# EAGLE design coronakiller_Zusatzplatine (EAGLE 9.6.2)
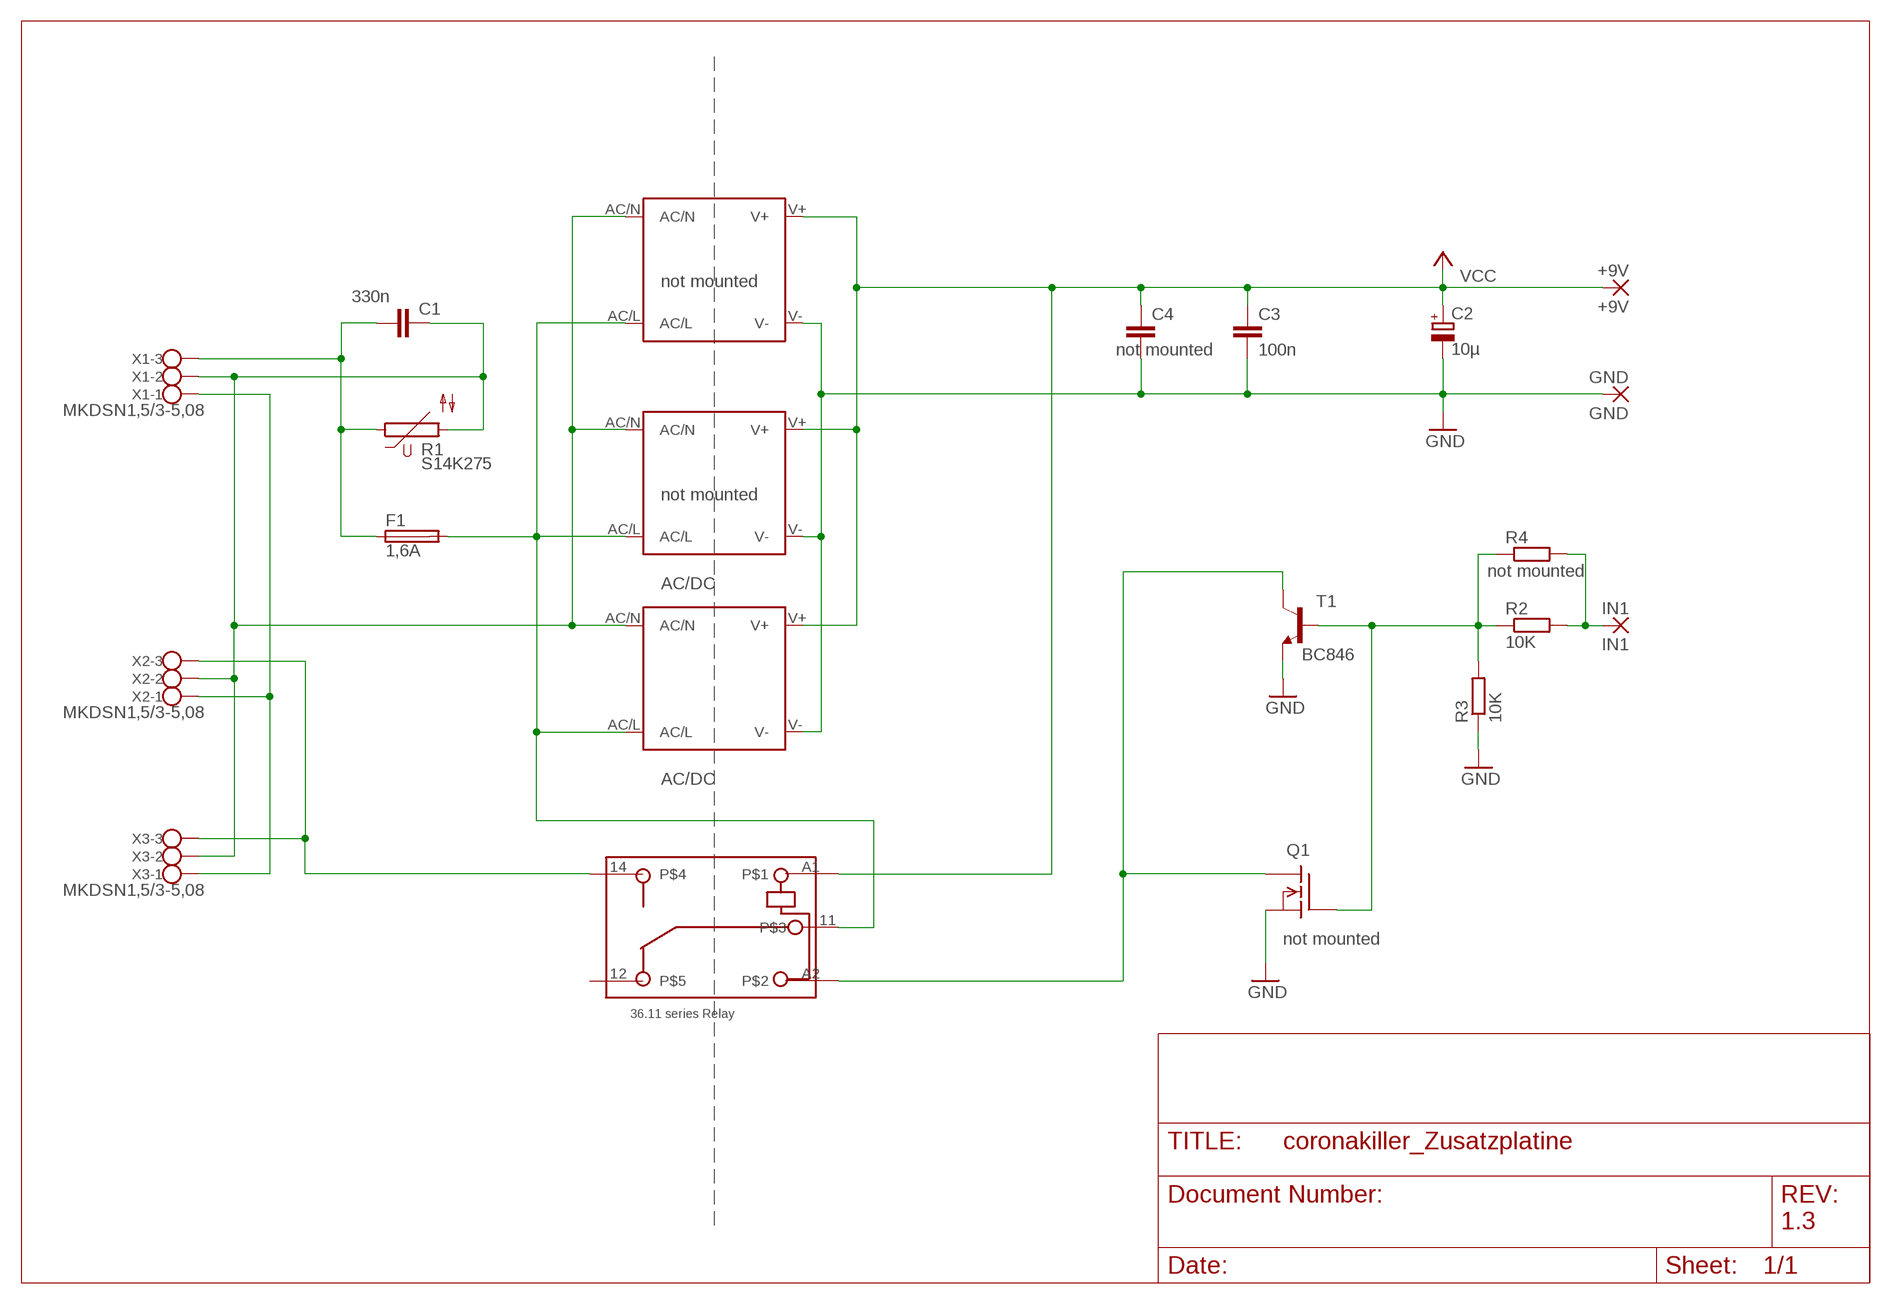
[diagram p0: schematic, sheet 1]

## Parts
+9V  +9V  2,54/1,0  [2,54/1,0]
AC/DC  AC/DC  IRM_03  [IRM_03]
C1  330n  C-EU150-054X183  [C150-054X183]
C2  10µ  CPOL-EUE2.5-6  [E2,5-6]
C3  100n  C-EUC0805  [C0805]
C4  not mounted  C-EU025-040X050  [C025-040X050]
F1  1,6A  FUSESH22,5  [SH22,5]
GND  GND  2,54/1,0  [2,54/1,0]
IN1  IN1  2,54/1,0  [2,54/1,0]
K1  36.11  [36.11]
Q1  BSS101  [TO92]
R1  S14K275  [S14K275]
R2  10K  R-EU_R0805  [R0805]
R3  10K  R-EU_R0805  [R0805]
R4  not mounted  R-EU_V526-0  [V526-0]
T1  BC846  [SOT23]
U$1  not mounted  IRM_01/02IRM_01/02  [IRM_01/02]
U$2  not mounted  IRM_01/02_SMDIRM_01/02_SMD  [IRM_01/02_SMD]
X1  MKDSN1,5/3-5,08  [MKDSN1,5/3-5,08]
X2  MKDSN1,5/3-5,08  [MKDSN1,5/3-5,08]
X3  MKDSN1,5/3-5,08  [MKDSN1,5/3-5,08]

## Nets
GND: AC/DC.V- C2.- C3.2 C4.2 GND.1(P) Q1.1(S) R3.1 T1.2(E) U$1.V- U$2.V-
N$1: C1.2 F1.1 R1.1 X1.3
N$2: AC/DC.AC/N C1.1 R1.2 U$1.AC/N U$2.AC/N X1.2 X2.2 X3.2
N$3: X1.1 X2.1 X3.1
N$4: AC/DC.AC/L F1.2 K1.11 U$1.AC/L U$2.AC/L
N$5: K1.A2 Q1.3(D) T1.3(C)
N$6: Q1.2(G) R2.1 R3.2 R4.1 T1.1(B)
N$7: IN1.1(P) R2.2 R4.2
N$8: K1.14 X2.3 X3.3
VCC: +9V.1(P) AC/DC.V+ C2.+ C3.1 C4.1 K1.A1 U$1.V+ U$2.V+
Unconnected: K1.12

## Notes on the sheet
- not mounted
- 1.3

## Library data of the parts
+9V GND IN1 = wirepad:2,54/1,0: THROUGH-HOLE PAD
AC/DC = meanwell_irm_v6:IRM_03: 3 watt IRM 03 Vout [V] Imax [A] Pmax [W] Eff [%] 3.3 0.9 3 68 5 0.6 3 72 9 0.33 3 77 12 0.25 3 78 15 0.2 3 78 24 0.125 3 80
C1 C3 C4 = rcl:C-EU: CAPACITOR, European symbol; SPICEPREFIX: C
C2 = rcl:CPOL-EU: POLARIZED CAPACITOR, European symbol; SPICEPREFIX: C
F1 = fuse:FUSE: Fuse; OC_FARNELL: unknown; OC_NEWARK: unknown
K1 = relay_finder_36_11:36.11: Printed circuit mount miniature 10 A relay one pole changeover contacts Conform RoHS
Q1 = transistor-fet:BSS101: N-Channel Enhancement MOSFET 200V; 0,16A; 11Ohm
R1 = varistor:S14K275: VARISTOR
R2-R4 = rcl:R-EU_: RESISTOR, European symbol; SPICEPREFIX: R
T1 = transistor-neu-to92:BC846: NPN TRANSISTOR
U$1 = OhneAlles:IRM_01/02: 1 or 2 watt housing & pin compatible IRM 01 Vout [V] Imax [A] Pmax [W] Eff [%] 3.3 0.3 1 66 5 0.2 1 70 9 0.111 1 72 12 0.083 1 74 15 0.067 1 75 24 0.042 1 77 IRM 2 Vout [V] Imax [A] Pmax [W] Eff [%] 3.3 0.6 2 66 5 0.4 2 70 9 0.222 2 72 12 0.167 2 74 15 0.133 2 75 24 0.087 2 77
U$2 = OhneAlles:IRM_01/02_SMD: 1 or 2 watt housing & pin compatible IRM 01 Vout [V] Imax [A] Pmax [W] Eff [%] 3.3 0.3 1 66 5 0.2 1 70 9 0.111 1 72 12 0.083 1 74 15 0.067 1 75 24 0.042 1 77 IRM 2 Vout [V] Imax [A] Pmax [W] Eff [%] 3.3 0.6 2 66 5 0.4 2 70 9 0.222 2 72 12 0.167 2 74 15 0.133 2 75 24 0.087 2 77
X1-X3 = con-phoenix-508:MKDSN1,5/3-5,08: MKDSN 1,5/ 3-5,08 Printklemme Nennstrom: 13,5 A Nennspannung: 250 V Rastermaß: 5,08 mm Polzahl: 3 Anschlussart: Schraubanschluss Montage: Löten Anschlussrichtung Leiter/Platine: 0 ° Artikelnummer: 1729131 Source: http://eshop.phoenixcontact.com .. 1729131.pdf

## Board
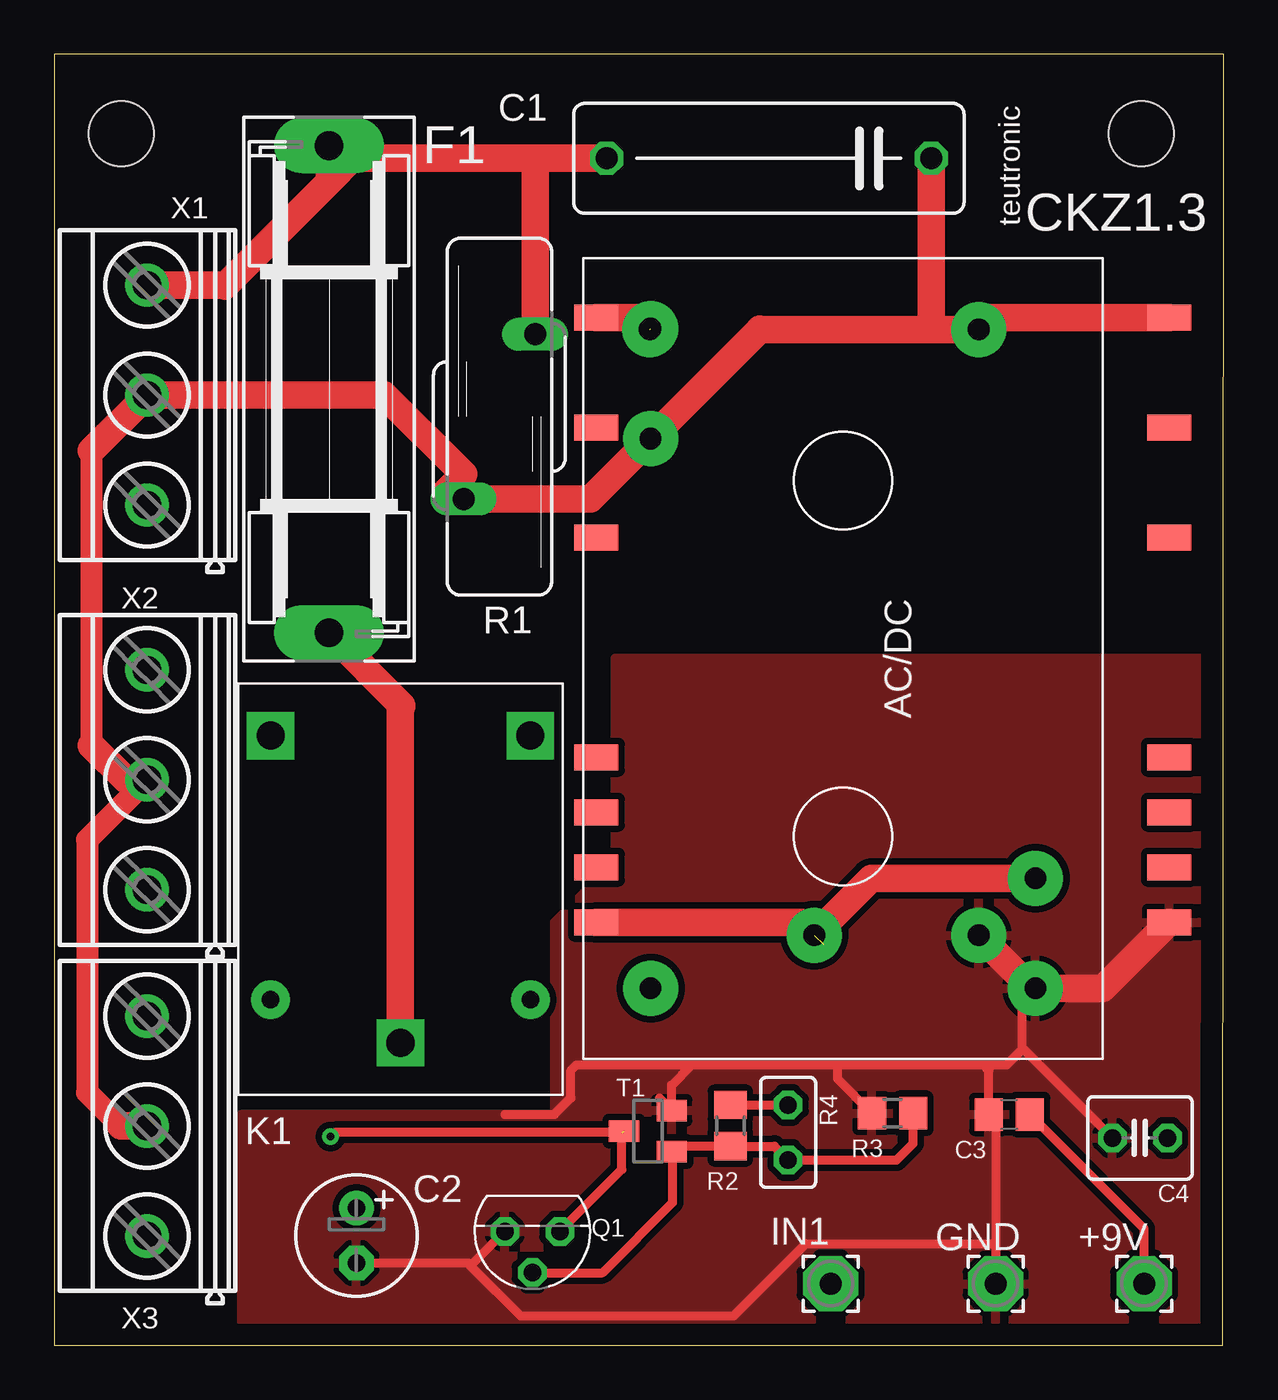
[diagram p1: board, top side]
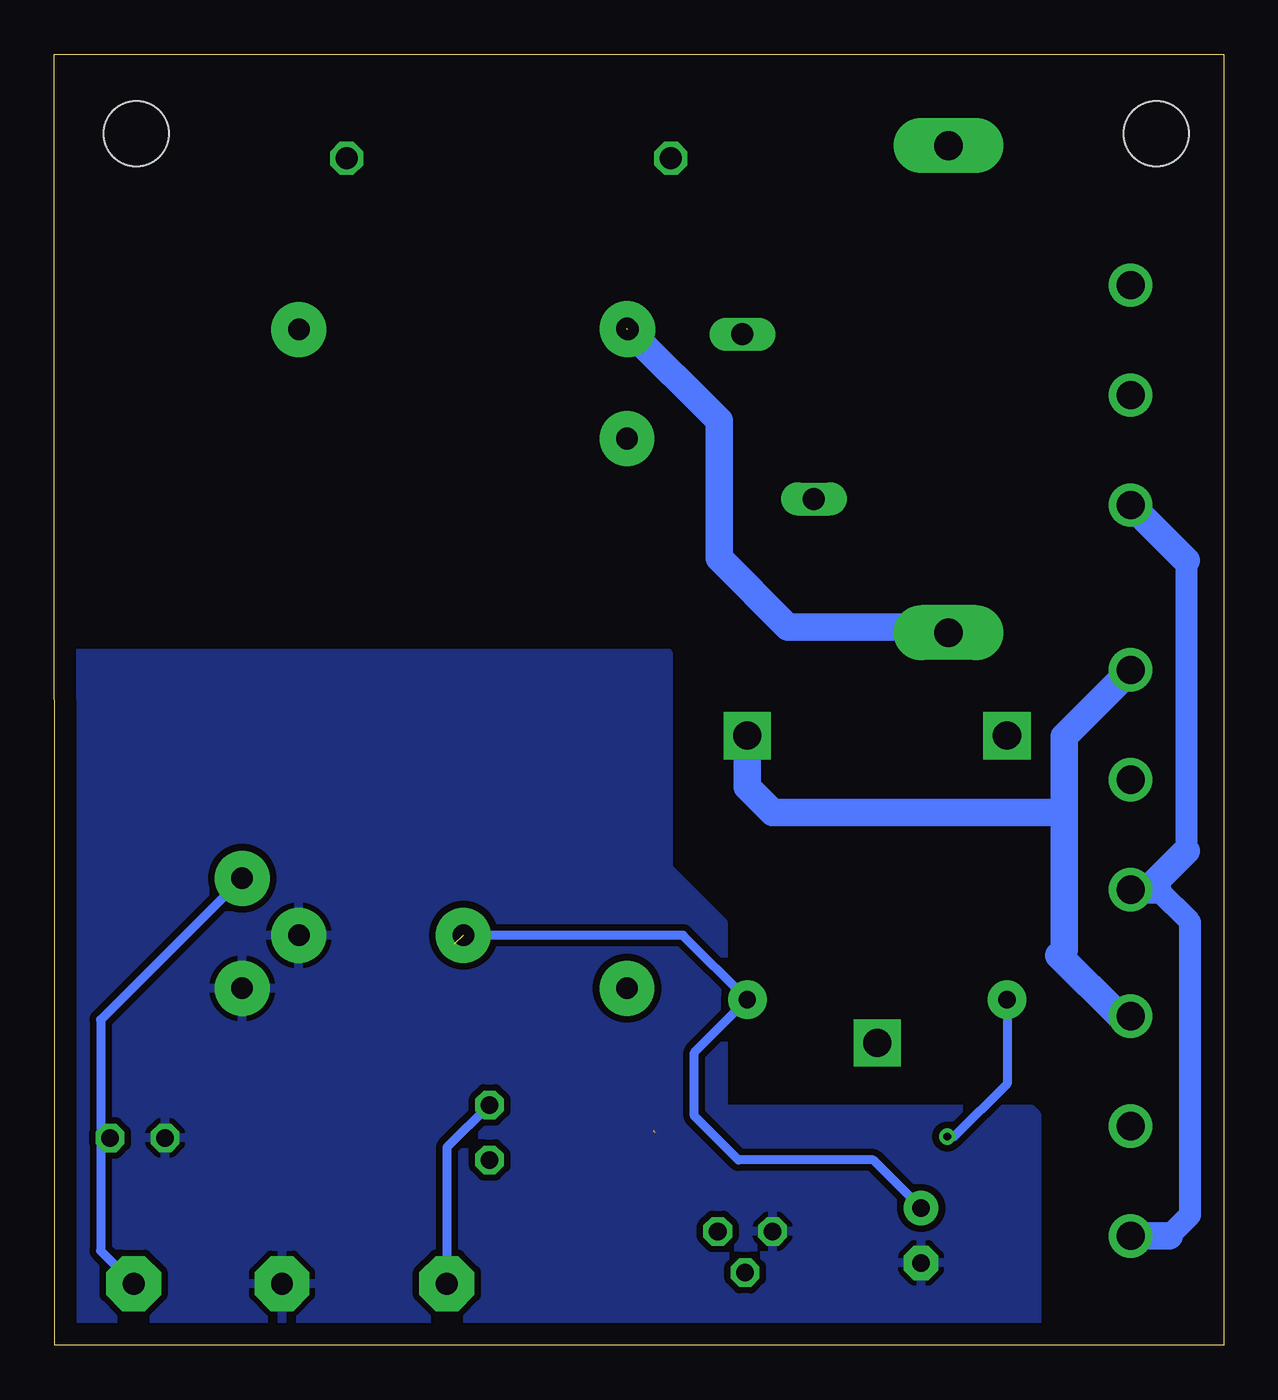
[diagram p2: board, bottom side, seen from below]

Size 54.03 x 59.68 mm. Coordinates in mm from the lower left corner, seen from the top.
Outline: 0,0 53.99,0 54.03,59.68 0,59.68 0,0
Copper layers (1*16): Top 0.035mm / dielectric 1.5mm / Bottom 0.035mm
Design rules "default *": minimum track width 6mil, minimum drill 0.35mm, track to track 12mil, track to pad 6mil, pad to pad 6mil, via to via 6mil, smd to smd 6mil, copper to edge 40mil, drill to drill 6mil, minimum pad ring 10mil, minimum via ring 8mil, stop-mask expansion 4mil, vias tented up to drill 0mil, thermal gap 10mil
Holes 3 mm at 3.1,56 50.23,56

### Footprints (pad centres in the part's own frame; a part is rotated, then mirrored left to right if it is on the bottom)
2,54/1,0 = drill 1.016 pad 2.54 octagon: 1 0,0
IRM_03 = drill 1 pad 2.54: AC/L -15.24,-8.89; AC/N -10.16,-8.89; NC 15.24,-8.89; V+ 10.16,8.89; V- 15.24,8.89
C150-054X183 = drill 1.016 octagon: 1 -7.493,0; 2 7.493,0
E2,5-6 = drill 0.813 pad 1.6: + -1.27,0 | drill 0.813 pad 1.6 octagon: - 1.27,0
C0805 = smd 1.3 x 1.5: 1 -0.95,0; 2 0.95,0
C025-040X050 = drill 0.813 octagon: 1 -1.27,0; 2 1.27,0
SH22,5 = drill 1.321 pad 2.54 long: 1 -11.252,0; 2 11.252,0
36.11 = drill 1.3 pad 2.184 square: 11 -7.1,0; 12 7.1,6; 14 7.1,-6 | drill 0.8 pad 1.778: A1 -5.1,-6; A2 -5.1,6
TO92 = drill 0.813 octagon: 1 1.27,0; 2 0,1.905; 3 -1.27,0
S14K275 = drill 1.016 long: 1 -1.651,-3.81; 2 1.651,3.81
R0805 = smd 1.3 x 1.5: 1 -0.95,0; 2 0.95,0
V526-0 = drill 0.813 octagon: 1 -1.27,0; 2 1.27,0
SOT23 = smd 1 x 1.4: 1 -0.95,-1.1; 2 0.95,-1.1; 3 0,1.1
IRM_01/02 = drill 1 pad 2.54: AC/L -14,-7.6; AC/N -14,7.6; V+ 14,0; V- 14,7.6
IRM_01/02_SMD = smd 1.2 x 2.03: AC/L -13.97,-13.235; AC/N -13.97,13.235; P$3 -8.89,-13.235; P$5 -3.81,-13.235; P$9 6.35,-13.235; P$10 8.89,-13.235; P$11 11.43,-13.235; P$14 11.43,13.235; P$15 8.89,13.235; P$16 6.35,13.235; P$20 -3.81,13.235; P$22 -8.89,13.235; V+ 13.97,-13.235; V- 13.97,13.235
MKDSN1,5/3-5,08 = drill 1.3 pad 2: 1 -7.641,0.025; 2 -2.561,0.025; 3 2.519,0.025

### Placement (x,y rotation side)
+9V  50.36,2.86 0 top
AC/DC  36.45,31.75 270 top
C1  33.02,54.86 180 top
C2  13.97,5.08 270 top
C3  44.13,10.67 180 top
C4  50.16,9.59 180 top
F1  12.7,44.2 270 top
GND  43.5,2.86 0 top
IN1  35.88,2.86 0 top
K1  16,21.08 90 top
Q1  22.1,5.27 180 top
R1  20.57,42.93 180 top
R2  31.24,10.16 90 top
R3  38.73,10.73 0 top
R4  33.91,9.84 90 top
T1  27.43,9.91 90 top
U$1  35.12,32.96 270 top
U$2  38.29,33.53 270 top
X1  4.32,46.48 90 top
X2  4.32,28.7 90 top
X3  4.32,12.7 90 top

### Tracks (layer width: path | path; a pad name or v marks a point on that pad's centre or on a via)
GND
  Top 0.152: 19.3,3.75 19.3,3.62
  Top 0.406: 27.96,11.43 T1.2 28.53,12.02 29.46,12.95 | 29.46,12.95 36.2,12.95 | 20.83,10.67 23.11,10.67 23.88,11.43 23.88,12.7 24.13,12.95 29.46,12.95 | 43.5,4.7 43.5,10.35 C3.2 43.18,12.7 42.93,12.95 | 43.5,4.7 GND.1 | 44.74,13.68 44.74,16.08 45.16,16.51 | R3.1 36.2,12.32 36.2,12.95 | 44.74,13.68 44.8,13.68 C4.2 | C2.- 19.11,3.81 19.3,3.62 21.56,1.36 31.4,1.36 34.73,4.7 43.5,4.7 | Q1.1 19.3,3.75 | 36.2,12.95 42.93,12.95 | 42.93,12.95 44.01,12.95 44.74,13.68
  Top 1.27: U$1.V- 45.16,16.51 AC/DC.V- 48.45,16.51 51.5,19.56 U$2.V-
  pour Top: 8.64,10.67 8.64,0 53.72,0 53.72,31.75 25.91,31.75 25.91,22.35 23.11,19.56 23.11,10.67
  pour Bottom: 25.65,32 25.65,22.1 23.11,19.56 23.11,10.92 8.89,10.92 8.64,10.67 8.64,0.25 54.9,0.25 53.66,1.49 53.66,32
N$1
  Top 1.27: X1.3 7.83,49 7.87,48.96 12.7,53.78 | 12.7,53.78 F1.1 | C1.2 21.91,54.86 | 21.91,54.86 13.78,54.86 12.7,53.78 | R1.1 22.23,54.55 21.91,54.86
N$2
  Top 0.152: R1.2 24.77,39.12
  Top 0.406: 3.32,26.14 X2.2 | 15.22,43.92 15.24,43.94
  Top 1.016: 1.73,41.35 1.73,27.74 | X2.2 1.52,23.37 1.52,11.68 3.07,10.14
  Top 1.27: U$2.AC/N 43.26,47.5 U$1.AC/N 40.51,46.96 | 1.73,41.35 X1.2 15.22,43.92 | 1.73,27.74 3.32,26.14 | 3.07,10.14 X3.2 | 15.24,43.94 18.92,40.26 18.1,39.43 18.1,39.24 18.22,39.12 24.77,39.12 AC/DC.AC/N 32.6,46.96 32.61,46.96 | 32.61,46.96 | 40.51,46.96 32.61,46.96 | C1.1 40.51,46.96
N$3
  Bottom 0.406: 3.53,21.06 X2.1
  Bottom 1.016: 2.51,5.06 1.54,6.03 1.54,19.57 3.03,21.06 | 1.73,36.27 1.73,22.86
  Bottom 1.27: X3.1 2.51,5.06 | 3.03,21.06 X2.1 | X1.1 1.73,36.27 | 1.73,22.86 3.53,21.06
N$4  (1 unrouted)
  Top 1.27: K1.11 16,29.46 16.07,29.53 16.07,29.58 F1.2 | U$2.AC/L 27.05,47.5 AC/DC.AC/L
  Bottom 1.27: F1.2 12.97,33.21 20.13,33.21 23.3,36.39 23.3,42.74 U$1.AC/L
N$5  (via drill 0.35)  (1 unrouted)
  Top 0.406: v12.76,9.65 12.95,9.84 26.23,9.84 | 26.23,9.84 26.25,9.82 | 26.23,9.84 26.23,8.13 Q1.3
  Bottom 0.406: K1.A2 10,12.1 12.45,9.65 v12.76,9.65
N$6
  Top 0.406: 39.31,10.73 R3.2 39.69,9.34 38.92,8.57 R4.1 33.27,9.21 R2.1 28.79,9.21 T1.1 28.57,8.91 28.57,6.6 25.34,3.37 Q1.2
N$7
  Top 0.406: R4.2 R2.2
  Bottom 0.406: R4.2 35.88,9.14 IN1.1
N$8
  Bottom 0.406: 7.37,18.29 7.62,18.03 | 4.8,15.22 X3.3
  Bottom 1.27: X2.3 7.37,28.15 7.37,24.64 | 7.62,18.03 4.8,15.22 | 7.37,24.64 7.37,18.29 | K1.14 22,25.81 20.83,24.64 7.37,24.64
VCC  (1 unrouted)
  Top 0.406: +9V.1 50.35,5.39 C3.1
  Top 1.27: U$2.V+ 34.54,19.56 35.56,18.54 | U$1.V+ 37.75,21.59 AC/DC.V+
  Bottom 0.406: C2.+ 16.19,8.57 22.42,8.57 24.45,10.6 24.45,13.54 K1.A1 24.98,18.96 U$1.V+ | AC/DC.V+ 51.88,15.05 51.88,9.53 | +9V.1 51.88,4.38 51.88,9.53 | C4.1 51.82,9.59 51.88,9.53

### Text on the board
tNames: CKZ1.3 | teutronic